# Altium schematic sheet SchemaPlaqueProjet.SchDoc
size A4
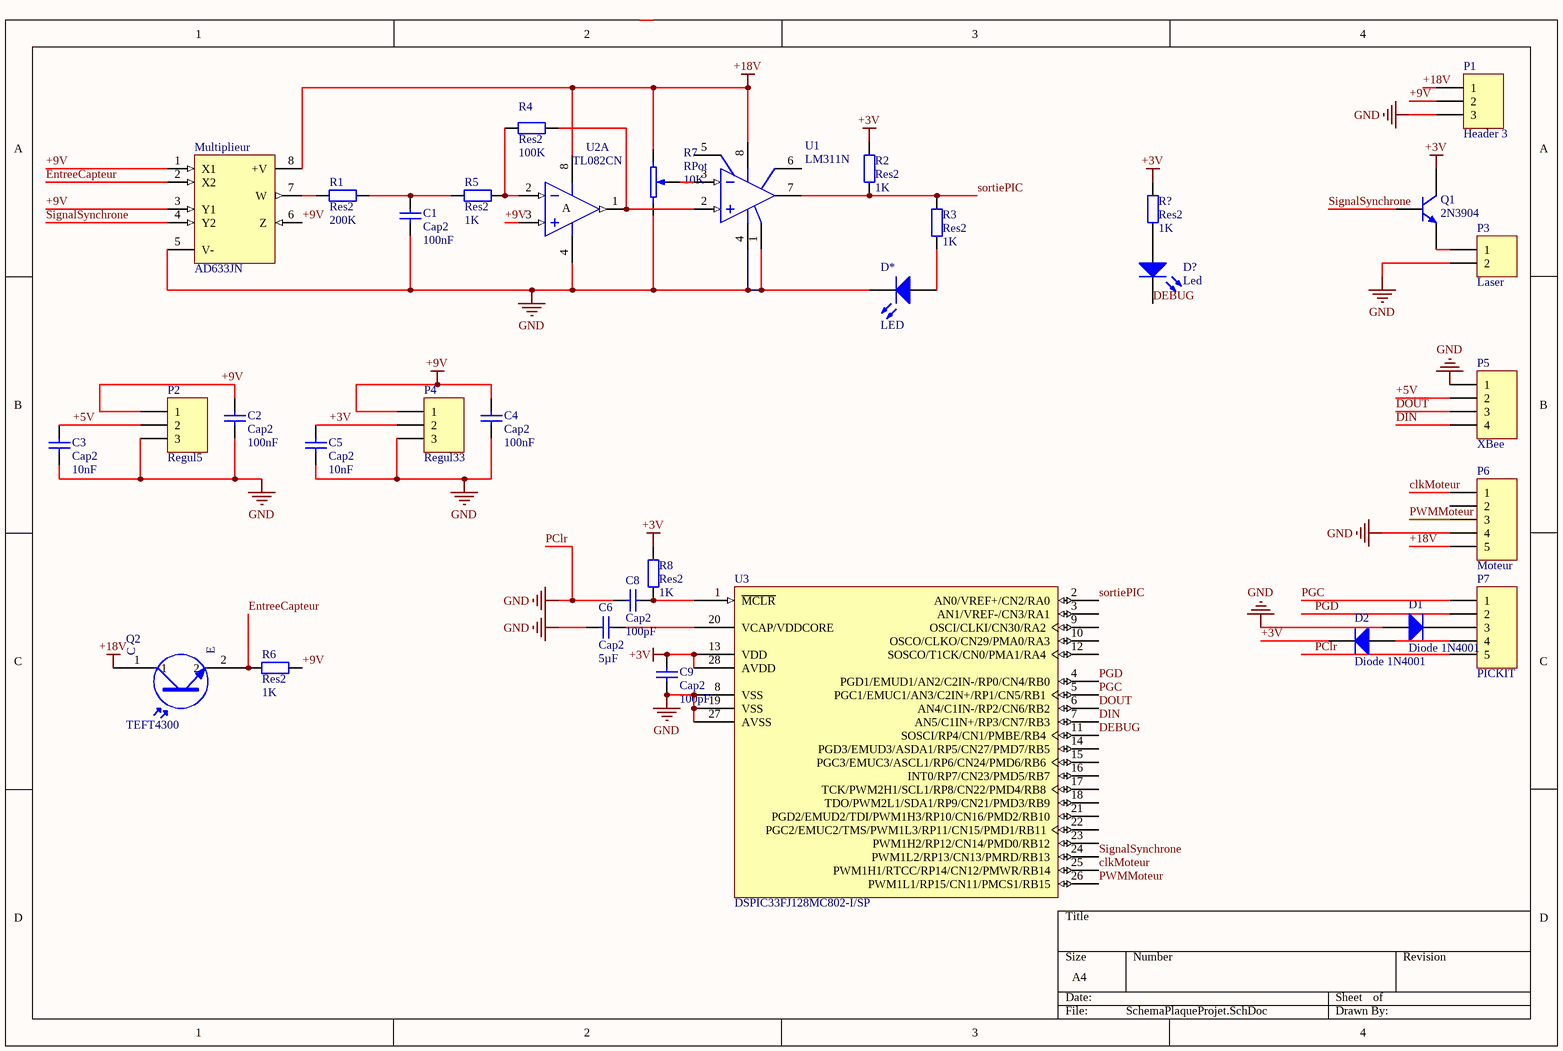
[diagram p0: SchemaPlaqueProjet.SchDoc]

## Parts
C1  Cap2  value 100nF  [CAPA2]
C2  Cap2  value 100nF  [CAPA2]
C3  Cap2  value 10nF  [CAPA2]
C4  Cap2  value 100nF  [CAPA2]
C5  Cap2  value 10nF  [CAPA2]
C6  Cap2  value 5µF  [CAPA2]
C8  Cap2  value 100pF  [CAPA2]
C9  Cap2  value 100pF  [CAPA2]
D1  Diode 1N4001  [Ddiode]
D2  Diode 1N4001  [Ddiode]
D*  LED  [Led_5mm]
D?  Led  [LED]
Multiplieur  AD633JN  [DIP8]
P1  Header 3  [HDR1X3]
P2  Regul5  [HDR1X3]
P3  Laser  [HDR1X2]
P4  Regul33  [HDR1X3]
P5  XBee  [HDR1X4]
P6  Moteur  [HDR1X5]
P7  PICKIT  [HDR1X5]
Q1  2N3904  [TO92]
Q2  TEFT4300  [Photo]
R1  Res2  value 200K  [res5_1/4W]
R2  Res2  value 1K  [res5_1/4W]
R3  Res2  value 1K  [res5_1/4W]
R4  Res2  value 100K  [res5_1/4W]
R5  Res2  value 1K  [res5_1/4W]
R6  Res2  value 1K  [res5_1/4W]
R7  RPot  value 10K  [AJUSTABLE]
R8  Res2  value 1K  [res5_1/4W]
R?  Res2  value 1K  [res5_1/4W]
U1  LM311N  [DIP8]
U2  TL082CN  [DIP8]  (part A of 2)
U3  DSPIC33FJ128MC802-I/SP  [SPDIP300-SP28]

## Nets
+3V: C5.1 C9.2 D2.2(K) P4.2 Q1.3(C) R2.2 R8.2 R?.2 U3.13(VDD) U3.28(AVDD)
+9V: C2.2 C4.2 Multiplieur.1(X1) Multiplieur.3(Y1) Multiplieur.6(Z) P1.2 P2.1 P4.1 R6.2 U2.3(IN+)
+18V: Multiplieur.8(+V) P1.1 P6.5 Q2.1 R7.1(BOT) U1.8(V+) U2.8(V+)
PClr: C1.1 C2.1 C3.2 C4.1 C5.2 C6.1 C8.2 C9.1 D1.1(A) D*.2(K) Multiplieur.5(V-) P1.3 P2.3 P3.2 P4.3 P5.1 P6.4 P7.5 R7.3(TOP) U1.1(GND) U1.4(V-_(CASE)) U2.4(V-) U3.8(VSS) U3.19(VSS) U3.27(AVSS)  [also labelled GND]
+5V: C3.1 P2.2 P5.2
clkMoteur: P6.1 U3.25(PWM1H1/RTCC/RP14/CN12/PMWR/RB14)
DEBUG: D?.2(K) U3.11(SOSCI/RP4/CN1/PMBE/RB4)
DIN: P5.4 U3.7(AN5/C1IN+/RP3/CN7/RB3)
DOUT: P5.3 U3.6(AN4/C1IN-/RP2/CN6/RB2)
EntreeCapteur: Multiplieur.2(X2) Q2.2 R6.1
PGC: P7.1 U3.5(PGC1/EMUC1/AN3/C2IN+/RP1/CN5/RB1)
PGD: P7.2 U3.4(PGD1/EMUD1/AN2/C2IN-/RP0/CN4/RB0)
PWMMoteur: P6.3 U3.26(PWM1L1/RP15/CN11/PMCS1/RB15)
SignalSynchrone: Multiplieur.4(Y2) Q1.2(B) U3.24(PWM1L2/RP13/CN13/PMRD/RB13)
sortiePIC: R2.1 R3.1 U1.7(OUT) U3.2(AN0/VREF+/CN2/RA0)
NetC1_2: C1.2 R1.2 R5.1
NetC6_2: C6.2 U3.20(VCAP/VDDCORE)
NetC8_1: C8.1 R8.1 U3.1(~{MCLR})
NetD1_2: D1.2(K) P7.3
NetD2_1: D2.1(A) P7.4
NetD*_1: D*.1(A) R3.2
NetD?_1: D?.1(A) R?.1
NetMultiplieur_7: Multiplieur.7(W) R1.1
NetP3_1: P3.1 Q1.1(E)
NetR4_1: R4.1 R5.2 U2.2(IN-)
NetR4_2: R4.2 U1.2(IN+) U2.1(OUT)
NetR7_2: R7.2(TAP) U1.3(IN-)

Not connected (* = marked no-connect by the designer): P6 2; U1 5(BAL) 6(BAL/STB); U3 3(AN1/VREF-/CN3/RA1) 9(OSCI/CLKI/CN30/RA2) 10(OSCO/CLKO/CN29/PMA0/RA3) 12(SOSCO/T1CK/CN0/PMA1/RA4) 14(PGD3/EMUD3/ASDA1/RP5/CN27/PMD7/RB5) 15(PGC3/EMUC3/ASCL1/RP6/CN24/PMD6/RB6) 16(INT0/RP7/CN23/PMD5/RB7) 17(TCK/PWM2H1/SCL1/RP8/CN22/PMD4/RB8) 18(TDO/PWM2L1/SDA1/RP9/CN21/PMD3/RB9) 21(PGD2/EMUD2/TDI/PWM1H3/RP10/CN16/PMD2/RB10) 22(PGC2/EMUC2/TMS/PWM1L3/RP11/CN15/PMD1/RB11) 23(PWM1H2/RP12/CN14/PMD0/RB12)

## Notes on the sheet
- (in symbol TEFT4300) C; E
- (in symbol TL082CN, part A) A

## Library data of the parts
C1-C6 C8 C9 = Cap2: Capacitor; Published: 8-Jun-2000; LatestRevisionDate: 17-Jul-2002; LatestRevisionNote: Re-released for DXP Platform.; PackageReference: RAD-0.3; Publisher: Altium Limited
D1 D2 = Diode 1N4001: 1 Amp General Purpose Rectifier; pin to pad: 1>A 2>K; Published: 8-Jun-2000; LatestRevisionDate: 17-Jul-2002; LatestRevisionNote: Re-released for DXP Platform.; DatasheetDocument: 1998; PackageDocument: Aug-1999; PackageReference: DO-41; Publisher: Altium Limited; Code_JEDEC: DO-204-AL; ComponentLink1Description: Manufacturer Link; ComponentLink1URL: http://www.fairchildsemi.com/; ComponentLink2Description: Datasheet; ComponentLink2URL: http://www.fairchildsemi.com/ds/1N%2F1N4001.pdf
Multiplieur = AD633JN: Low-Cost Analog Multiplier; Published: 8-Jun-2000; LatestRevisionDate: 04-Mar-2005; LatestRevisionNote: Stylized 3D Model Added.; DatasheetVersion: REV.A 1998; PackageVersion: revA; PackageReference: N-8; Publisher: Altium Limited; PackageDescription: DIP; 8 Leads; Row Spacing 7.62 mm; Pitch 2.54 mm; ComponentLink1Description: Manufacturer Link; ComponentLink1URL: http://www.analog.com/en/prod/0%2C2877%2CAD633%2C00.html; ComponentLink2Description: Datasheet; ComponentLink2URL: http://www.analog.com/UploadedFiles/Data_Sheets/277093686AD633_e.pdf
P1 P2 P4 = Header 3: Header, 3-Pin; LatestRevisionDate: 17-Jul-2002; LatestRevisionNote: Re-released for DXP Platform.; Publisher: Altium Limited
P3 = Header 2: Header, 2-Pin; LatestRevisionDate: 17-Jul-2002; LatestRevisionNote: Re-released for DXP Platform.; Publisher: Altium Limited
P5 = Header 4: Header, 4-Pin; LatestRevisionDate: 17-Jul-2002; LatestRevisionNote: Re-released for DXP Platform.; Publisher: Altium Limited
P6 P7 = Header 5: Header, 5-Pin; LatestRevisionDate: 17-Jul-2002; LatestRevisionNote: Re-released for DXP Platform.; Publisher: Altium Limited
Q1 = 2N3904: NPN General Purpose Amplifier; Published: 8-Jun-2000; LatestRevisionDate: 15-Jan-2003; LatestRevisionNote: PCB Footprint 'BCY-W3/D4.7' replaced; DatasheetDocument: 1997; PackageDocument: Sep-1998; PackageReference: TO-92A; Publisher: Altium Limited; Code_JEDEC: TO-92A; ComponentLink1Description: Manufacturer Link; ComponentLink1URL: http://www.fairchildsemi.com/; ComponentLink2Description: Datasheet; ComponentLink2URL: http://www.fairchildsemi.com/ds/2N%2F2N3904.pdf
Q2 = TEFT4300: NPN Phototransistor; Published: 24-Mar-1999; LatestRevisionDate: 17-Jul-2002; LatestRevisionNote: Re-released for DXP Platform.; PackageReference: TO-220_A; Publisher: Altium Limited; Code_JEDEC: TO-220-AC
R1-R6 R8 R? = Res2: Resistor; Published: 8-Jun-2000; LatestRevisionDate: 17-Jul-2002; LatestRevisionNote: Re-released for DXP Platform.; PackageReference: AXIAL-0.4; Publisher: Altium Limited
R7 = RPot: Potentiometer; Sim Note: Enter the Resistance value and the set point into parameter fields.; Set Position: 0.5; Published: 8-Jun-2000; LatestRevisionDate: 17-Jul-2002; LatestRevisionNote: Re-released for DXP Platform.; PackageReference: VR5; Publisher: Altium Limited
U1 = LM311N: Voltage Comparator; Published: 24-Aug-2001; LatestRevisionDate: 06-Jun-2005; LatestRevisionNote: Stylized 3D Model Added.; DatasheetVersion: Oct-1997; PackageReference: DIP8; Publisher: Altium Limited; PackageDescription: DIP; 8 Leads; Row Spacing 7.62 mm; Pitch 2.54 mm; Code_JEDEC: MO-001-AN; ComponentLink1Description: Manufacturer Link; ComponentLink1URL: http://www.st.com/; ComponentLink2Description: Datasheet; ComponentLink2URL: http://www.st.com/stonline/products/literature/ds/4848/lm211.pdf
U2 = TL082CN: General-Purpose J-FET Dual Operational Amplifier; Published: 24-Aug-2001; LatestRevisionDate: 06-Jun-2005; LatestRevisionNote: Stylized 3D Model Added.; DatasheetVersion: Jan-1999; PackageReference: DIP8; Publisher: Altium Limited; PackageDescription: DIP; 8 Leads; Row Spacing 7.62 mm; Pitch 2.54 mm; Code_JEDEC: MO-001-AN; ComponentLink1Description: Manufacturer Link; ComponentLink1URL: http://www.st.com/; ComponentLink2Description: Datasheet; ComponentLink2URL: http://www.st.com/stonline/products/literature/ds/2300/tl082.pdf
U3 = DSPIC33FJ128MC802-I/SP: High-Performance 16-bit Digital Signal Controller, 128 KB Flash, 16 KB RAM, 28-Pin SPDIP, Industrial Temperature; Published: 29-Jan-2009; DatasheetVersion: revB, Mar-2008; PackageVersion: revAW, Oct-2008; PackageReference: SPDIP300-SP28; Publisher: Altium Limited; PackageDescription: 28-Lead Skinny Plastic Dual In-Line (SP) - 300 mil Body [SPDIP]; ComponentLink1Description: Manufacturer Link; ComponentLink1URL: http://www.microchip.com; ComponentLink2Description: Datasheet; ComponentLink2URL: http://ww1.microchip.com/downloads/en/DeviceDoc/70291B.pdf; ComponentLink3Description: Packaging Specification; ComponentLink3URL: http://ww1.microchip.com/downloads/en/PackagingSpec/00049AW.pdf
D? = Led: Published: 8-Jun-2000; LatestRevisionDate: 17-Jul-2002; LatestRevisionNote: Re-released for DXP Platform.; DatasheetDocument: 1998; PackageDocument: Aug-1999; PackageReference: DO-41; Publisher: Altium Limited; Code_JEDEC: DO-204-AL; ComponentLink1Description: Manufacturer Link; ComponentLink1URL: http://www.fairchildsemi.com/; ComponentLink2Description: Datasheet; ComponentLink2URL: http://www.fairchildsemi.com/ds/1N%2F1N4001.pdf